# Altium schematic sheet main.SchDoc
size A
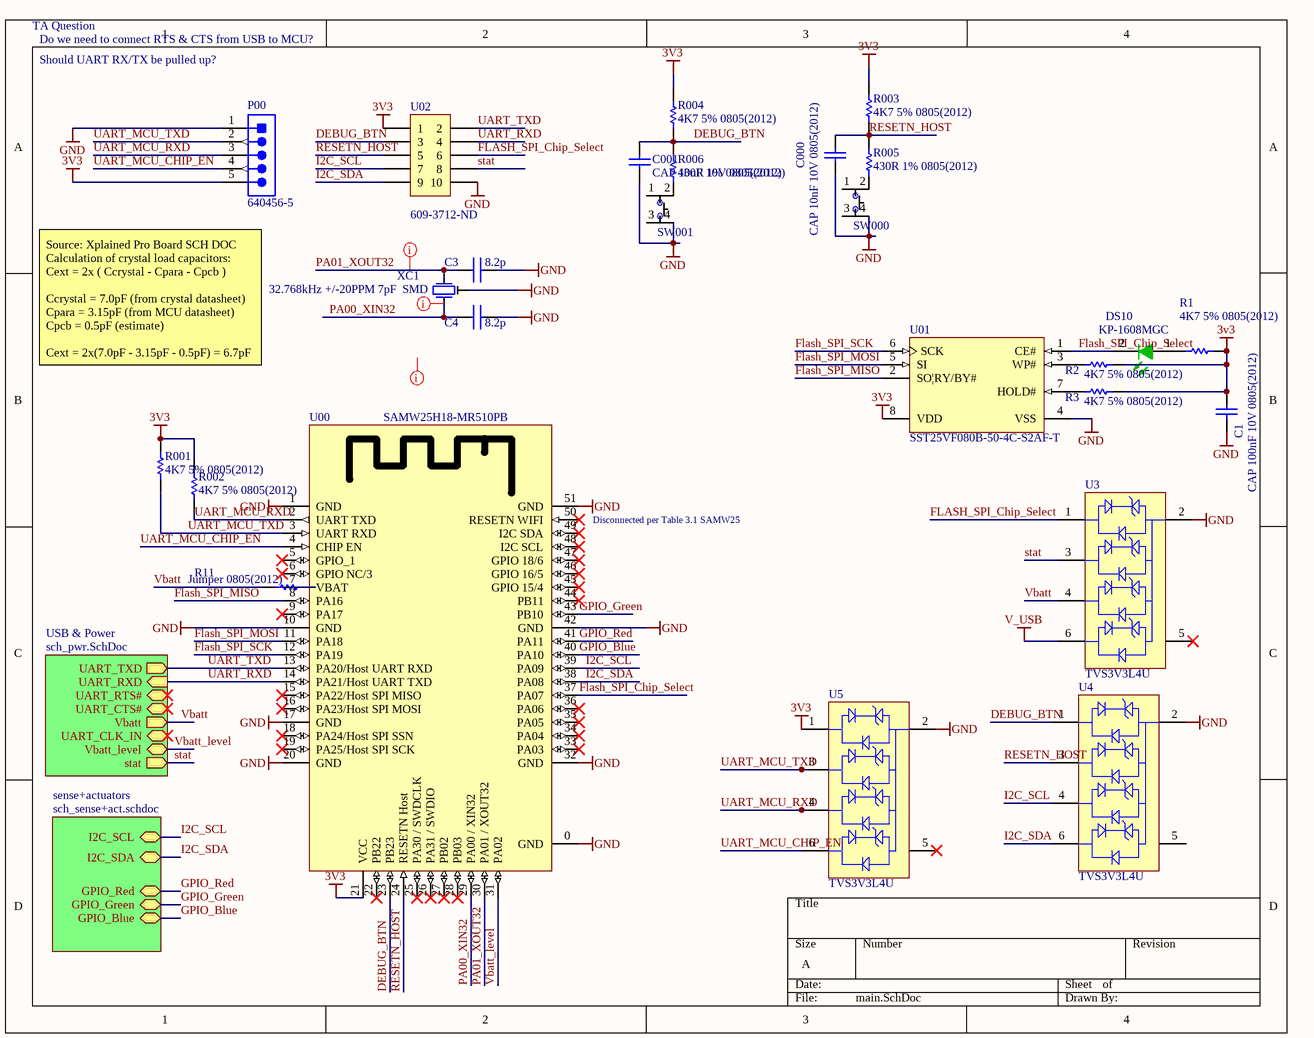
[diagram p0: main.SchDoc]

## Parts
C000  CAP 10nF 10V 0805(2012)  [CAPC0805(2012)75_L]
C1  CAP 100nF 10V 0805(2012)  [CAPC0805(2012)100_N]
C001  CAP 10nF 10V 0805(2012)  [CAPC0805(2012)75_L]
C3  value 8.2p  [AP1-00001]  (hidden comment: CAP-NONPOL)
C4  value 8.2p  [AP1-00001]  (hidden comment: CAP-NONPOL)
DS10  KP-1608MGC  [KING-0603LED_GREEN_V]
P00  640456-5  [TECO-640456-5]
R001  4K7 5% 0805(2012)  [RESC0805(2012)_N]
R1  4K7 5% 0805(2012)  [RESC0805(2012)_N]
R002  4K7 5% 0805(2012)  [RESC0805(2012)_N]
R2  4K7 5% 0805(2012)  [RESC0805(2012)_N]
R003  4K7 5% 0805(2012)  [RESC0805(2012)_N]
R3  4K7 5% 0805(2012)  [RESC0805(2012)_N]
R004  4K7 5% 0805(2012)  [RESC0805(2012)_N]
R005  430R 1% 0805(2012)  [RESC0805(2012)_L]
R006  430R 1% 0805(2012)  [RESC0805(2012)_L]
R11  Jumper 0805(2012)  [RESC0805(2012)_N]
SW000  TL3300DF260Q  [TL3300DF260Q]  (value not drawn)
SW001  TL3300DF260Q  [TL3300DF260Q]  (value not drawn)
U00  SAMW25H18-MR510PB  [SAMW25H18-MR510PB]
U01  SST25VF080B-50-4C-S2AF-T  [MCHP-SOIC-S2A8_N]
U02  Supplier Part Number 1: 609-3712-ND  [20021111-00010T4LF]  (hidden comment: 20021111-00010T4LF)
U3  TVS3V3L4U  [INF-SC74_N]
U4  TVS3V3L4U  [INF-SC74_N]
U5  TVS3V3L4U  [INF-SC74_N]
XC1  value 32.768kHz +/-20PPM 7pF  SMD  [AP7-00044]  (hidden comment: Farnell order no:1539364)

## Sub-sheets
sense+actuators = sch_sense+act.schdoc: I2C_SCL (bidir), I2C_SDA (bidir), GPIO_Red (bidir), GPIO_Green (bidir), GPIO_Blue (bidir)
USB & Power = sch_pwr.SchDoc: stat (out), UART_RXD (in), UART_TXD (out), UART_RTS#, UART_CTS#, UART_CLK_IN, Vbatt_level (bidir), Vbatt (out)

## Nets
3V3: C1.1 P00.5(CTS) R001.1 R1.1 R002.1 R2.1 R003.1 R3.1 R004.1 U00.21(VCC) U01.8(VDD) U02.1 U5.1(C)
GND: C000.1 C001.1 C1.2 C3.2 C4.2 P00.1(DTR) SW000.4 SW001.4 U00.0(GND) U00.1(GND) U00.10(GND) U00.17(GND) U00.20(GND) U00.32(GND) U00.42(GND) U00.51(GND) U01.4(VSS) U02.10 U3.2(C) U4.2(C) U5.2(C) XC1.3
V_USB: U3.6(C)
DEBUG_BTN: C001.2 R004.2 R006.2 U00.23(PB23) U02.3 U4.1(C)
FLASH_SPI_Chip_Select: DS10.2(K) U00.37(PA07) U01.1(CE#) U02.6 U3.1(C)
Flash_SPI_MISO: U00.8(PA16) U01.2(SO|RY/BY#)
Flash_SPI_MOSI: U00.11(PA18) U01.5(SI)
Flash_SPI_SCK: U00.12(PA19) U01.6(SCK)
GPIO_Blue: U00.40(PA10) ; sheet sense+actuators/GPIO_Blue
GPIO_Green: U00.43(PB10) ; sheet sense+actuators/GPIO_Green
GPIO_Red: U00.41(PA11) ; sheet sense+actuators/GPIO_Red
I2C_SCL: U00.39(PA09) U02.7 U4.4(C) ; sheet sense+actuators/I2C_SCL
I2C_SDA: U00.38(PA08) U02.9 U4.6(C) ; sheet sense+actuators/I2C_SDA
PA00_XIN32: C4.1 U00.29(PA00_/_XIN32) XC1.2
PA01_XOUT32: C3.1 U00.30(PA01_/_XOUT32) XC1.1
RESETN_HOST: C000.2 R003.2 R005.2 U00.24(RESETN_Host) U02.5 U4.3(C)
stat: U02.8 U3.3(C) ; sheet USB & Power/stat
UART_MCU_CHIP_EN: P00.4(VCC) U00.4(CHIP_EN) U5.6(C)
UART_MCU_RXD: P00.3(TXO) R002.2 U00.2(UART_TXD) U5.4(C)
UART_MCU_TXD: P00.2(RXI) R001.2 U00.3(UART_RXD) U5.3(C)
UART_RXD: U00.14(PA21/Host_UART_TXD) U02.4 ; sheet USB & Power/UART_RXD
UART_TXD: U00.13(PA20/Host_UART_RXD) U02.2 ; sheet USB & Power/UART_TXD
Vbatt: R11.1 U3.4(C) ; sheet USB & Power/Vbatt
Vbatt_level: U00.31(PA02) ; sheet USB & Power/Vbatt_level
NetR2_2: R2.2 U01.3(WP#)
NetR3_2: R3.2 U01.7(HOLD#)
NetR005_1: R005.1 SW000.2
NetR006_1: R006.1 SW001.2
NetR11_2: R11.2 U00.7(VBAT)

Not connected (* = marked no-connect by the designer): DS10 1(A); R1 2; SW000 1 3; SW001 1 3; U00 5(GPIO_1)* 6(GPIO_NC/3)* 9(PA17)* 15(PA22/Host_SPI_MISO)* 16(PA23/Host_SPI_MOSI)* 18(PA24/Host_SPI_SSN)* 19(PA25/Host_SPI_SCK)* 22(PB22)* 25(PA30_/_SWDCLK)* 26(PA31_/_SWDIO)* 27(PB02)* 28(PB03)* 33(PA03)* 34(PA04)* 35(PA05)* 36(PA06)* 44(PB11)* 45(GPIO_15/4)* 46(GPIO_16/5)* 47(GPIO_18/6)* 48(I2C_SCL)* 49(I2C_SDA)* 50(RESETN_WIFI)*; U3 5(NC)*; U4 5(NC); U5 5(NC)*

## Layout directives
rule Assembly Testpoint Usage [Testpoint - Not Allowed    Multiple - Not Allowed]: (no net found under the mark), PA00_XIN32, PA01_XOUT32

## Notes on the sheet
- TA Question
- Do we need to connect RTS & CTS from USB to MCU?
- Should UART RX/TX be pulled up?
- (near P00) Source: Xplained Pro Board SCH DOC
  Calculation of crystal load capacitors:
  Cext = 2x ( Ccrystal - Cpara - Cpcb )
  Ccrystal = 7.0pF (from crystal datasheet)
  Cpara = 3.15pF (from MCU datasheet)
  Cpcb = 0.5pF (estimate)
  Cext = 2x(7.0pF - 3.15pF - 0.5pF) = 6.7pF
- (near U00) Disconnected per Table 3.1 SAMW25

## Library data of the parts
C000 C001 = CMP-1036-03812-1: CAP 10nF 10V -20% to +80% 0805 (2012 Metric) Thickness 0.75mm SMD; Case-EIA: 0805; Case-Metric: 2012; Technology: SMT; Max Thickness: 0.75 mm; Value: 10nF; Rated Voltage: 10 V; Tolerance: -20% to +80%
C1 = CMP-1036-04396-1: CAP 100nF 10V ±20% 0805 (2012 Metric) Thickness 1mm SMD; Tolerance: Â±20%; Case-Metric: 2012; Case-EIA: 0805; Rated Voltage: 10 V; Value: 100nF; Technology: SMT; Max Thickness: 1 mm
C3 C4 = A01-0014: Ceramic capacitor, SMD 0402, NP0, 50V, +/-5%; PartGroup: Capacitors,Ceramic,SMD 0402; TemperatureRange: -55 - +125 deg C; ComponentStatus: 'Active (verified)'; Status: Active; Verified by: Lars Helge Mo; Verified date: 2005-12-15; AN: A01-0014; Tolerance: 50V, +/-5%; Height: 0.550000011920929; FootprintStatus: 'Active (Verified)'
DS10 = CMP-0404-00001-1: LED, SMT, 0603(1608), 1.1mm thickness, Green; Manufacturer: Kingbright; Reverse Voltage: 5 V; Power Dissipation: 75 mW; Forward Current: 30 mA; Packing Type: 2000 pcs / reel; Mounting Technology: Surface Mount; Storage Temperature: -40 to +85 degC; ComponentLink1URL: http://www.kingbright.com/; PackageDescription: 2-Pin SMT LED, 1.6 x 0.8 mm Pitch; PartNumber: KP-1608MGC; PackageReference: 0603LED_GREEN; ComponentLink1Description: Manufacturer URL
P00 = CMP-1684-00014-1: Male Header, Pitch 2.54 mm, 1 x 5 Position, Height 10.03 mm, Tail Length 3.56 mm, / -55 to 105 degC, RoHS, Bulk; Manufacturer: TE Connectivity; Material, Housing: Polyester; Brand/Series: MTA-100Series; Color, Housing: White; Current, Rating: 5 / A; Temperature, Operating: -55to+105 / °C; Connector Type: MTA-100; Agency Approvals: CSA,UL; Material, Contact: CopperAlloy; Mounting Hole Size: 0.04 / "; Voltage, Rating: 250 / V; Contact Termination Area Plating: Tin; Pin Spacing: 0.1 / "; Primary Type: InterconnectSystem; Special Features: Pinstrip; Mount Angle: Vertical; Contact Centerline Spacing: 0.100 / in.; Number of Contacts: 5; Standards: RoHSCompliant,ELVCompliant,UL94V-0; Angle: Straight; Length, Terminal Post: 0.14 / in.; Manufacturer URL: http://www.te.com; Flammability Rating: UL94V-0; Mounting Type: PCMount; Termination: Solder; Package Reference: THD; Length, Overall: 0.5 / "; Contact Mating Area Plating: Tin; Length, Pin: 0.14 / "; Datasheet URL: http://sigma.octopart.com/77881742/technical_drawing/TE-Connectivity-640456-5.pdf; Package Description: Male Header, Pitch 2.54 mm, 1 x 5 Position, Height 10.03 mm, Tail Length 3.56 mm; Datasheet Version: Rev. W3; Contact Plating: Tin; Color: White; Number of Positions: 5; Type: PCBPlug; Contact Shape: Square; Number of Rows: 1; Size, Post: 0.025 / in.
R001 R1 R002 R2 R003 R3 R004 = CMP-1013-00090-1: 4K7 0.125W 5% 0805 (2012 Metric)  SMD; Case-EIA: 0805; Value: 4700.00 Ohm; Case-Metric: 2012; Power: 0.125 W; Tolerance: 5 %; Technology: SMT
R005 R006 = CMP-1013-00468-1: 430R 0.125W 1% 0805 (2012 Metric)  SMD; Value: 430.00 Ohm; Case-Metric: 2012; Case-EIA: 0805; Power: 0.125 W; Tolerance: 1 %; Technology: SMT
R11 = CMP-1013-00001-1: Jumper 0805 (2012 Metric); Case-EIA: 0805; Value: 0.00 Ohm; Tolerance: None; Case-Metric: 2012; Technology: SMT; Power: None
SW000 SW001 = TL3300DF260Q: SWITCH TACTILE SPST-NO 0.05A 12V; Manufacturer: E-Switch; Mechanical Life: 100000Cycles; Operating Force: 260gf; Current Rating: 50mA; Illumination Type: Non-Illuminated; Throw Configuration: SPST; Switch Travel: 0.35mm; Supplier 1: Digi-Key; Manufacturer Part Number: TL3300DF260Q; Stock 1: 7332; Pricing 1: 1=0.55, 10=0.529, 25=0.5188, 50=0.4992, 100=0.4308, 250=0.3916 (USD); Case/Package: SMD/SMT; Contact Plating: Silver; Min Operating Temperature: -25°C; Max Operating Temperature: 70°C; Package Quantity: 1; Packaging: Tape and Reel; Voltage Rating (DC): 12V; Termination: Gull Wing; Lead Free: Lead Free; ComponentLink1URL: https://datasheet.ciiva.com/2901/n301104-2901040.pdf; ComponentLink1Description: https://datasheet.ciiva.com/2901/n301104-2901040.pdf; Supplier Part Number 1: EG4907CT-ND
U00 = SAMW25H18-MR510PB: RF TXRX MODULE WIFI TRACE ANT; Manufacturer: Atmel; Manufacturer Part Number: ATSAMW25H18-MR510PB; Protocol: 802.11b/g/n; Frequency: 2.4GHz; Data Rate: 65Mbps; Power - Output: 17dBm; Sensitivity: -95.5dBm; Serial Interfaces: SPI, UART; Antenna Type: Integrated, Trace; Memory Size: 256kB Flash, 32kB SRAM; Voltage - Supply: 2.7 V ~ 4.2 V; Category: RF/IF and RFID; Family: RF Transceiver Modules; Series: Xplained Pro; Packaging: Tray; RF Family/Standard: WiFi; Modulation: -; Current - Receiving: -; Current - Transmitting: -; Mounting Type: Surface Mount; Operating Temperature: -40°C ~ 85°C; Package / Case: Module; ComponentLink1URL: http://www.atmel.com/devices/ATSAMW25.aspx; ComponentLink1Description: http://www.atmel.com/devices/ATSAMW25.aspx; ComponentLink2URL: http://www.farnell.com/datasheets/1965115.pdf; ComponentLink2Description: http://www.farnell.com/datasheets/1965115.pdf; Supplier 1: Digikey; Stock 1: 120; Pricing 1: 1=19.14 (USD); Supplier Part Number 1: ATSAMW25H18-MR510PB-ND
U01 = CMP-0378-00054-1: 8 Mbit SPI Serial Flash, 2.7 to 3.6 V, 50 MHz, 0 to 70 degC, 8-pin SOIC (S2A8), Tape and Reel; Manufacturer: Microchip; Mounting Technology: Surface Mount; ComponentLink2Description: Datasheet; PackageDescription: 8-Lead Plastic Small Outline Intergrated Circuit, 5.275 x 5.275 mm Body, 1.27 mm Pitch; DatasheetVersion: Rev. A; ComponentLink1Description: Manufacturer URL; PackageVersion: Rev. A; ComponentLink3Description: Package Specification; PackageReference: SOIC-S2A8; ComponentLink3URL: http://ww1.microchip.com/downloads/en/DeviceDoc/25051A.pdf; ComponentLink4Description: Product URL; ComponentLink2URL: http://ww1.microchip.com/downloads/en/DeviceDoc/25045A.pdf; PartNumber: SST25VF080B-50-4C-S2AF-T; ComponentLink4URL: http://www.microchip.com/SST25VF080B; ComponentLink1URL: http://www.microchip.com
U02 = 20021111-00010T4LF: CONN HEADER 10POS UNSHD VERT T/H; Manufacturer: Amphenol / FCI; Stack Height: 2.5 mm; Number of Positions / Contacts: 10; Brand: FCI; Pitch: 1.27 mm; Mounting Angle: Vertical; Current Rating: 10 A; Mating Post Length: 3.05 mm; Voltage Rating: 125 V; Manufacturer Part Number: 20021111-00010T4LF; Mounting Style: Through Hole; Product Category: Headers & Wire Housings; RoHS: Details; Series: Minitek; Product Type: Headers; Type: Unshrouded; Number of Positions: 10; Number of Rows: 2; Contact Plating: Gold; Housing Material: Plastic; Termination Style: Through Hole; Contact Material: Nickel; Packaging: Tube; Factory Pack Quantity: 93; Termination Post Length: 2.3 mm; ComponentLink1URL: https://datasheet.ciiva.com/1433/1079612-1433267.pdf; ComponentLink1Description: https://datasheet.ciiva.com/1433/1079612-1433267.pdf; ComponentLink2URL: https://datasheet.ciiva.com/409/20021111-409158.pdf; ComponentLink2Description: https://datasheet.ciiva.com/409/20021111-409158.pdf; ComponentLink3URL: https://datasheet.ciiva.com/5131/20021111-5131386.pdf; ComponentLink3Description: https://datasheet.ciiva.com/5131/20021111-5131386.pdf; ComponentLink4URL: https://datasheet.ciiva.com/9465/20021111-9465402.pdf; ComponentLink4Description: https://datasheet.ciiva.com/9465/20021111-9465402.pdf; Supplier 1: Digi-Key
U3-U5 = CMP-1179-00001-1: Low Capacitance ESD / Transient / Surge Protection Array, -55 to 125 degC, SC74, Reel, Green; Manufacturer: Infineon; VESD (max): 30Â kV; VESD (min): -30Â kV; CL (typ): 2Â pF; CL (max): 3Â pF; IR (max): 50Â uA; IEFT: 80 A; VRWM: 3.3Â V; Green: TRUE; Rdyn typ reverse: 9Â Ohm; Rdyn typ forward: 0.12Â Ohm; ComponentLink2Description: Datasheet; Mounting Technology: Surface Mount; ComponentLink3Description: Package Specification; ComponentLink2URL: http://www.infineon.com/dgdl/TVS3V3L4U_rev_2_2.pdf?folderId=db3a30431f848401011fcbf2ab4c04c4&fileId=db3a3043382e837301385be7912532ed; ComponentLink1Description: Manufacturer URL; PackageDescription: 6-Pin Semiconductor Package, 2.9 x 1.6 mm Body, 0.95 mm Pitch; ComponentLink3URL: http://www.infineon.com/dgdl/SC74-Package_Overview.pdf?folderId=db3a30431936bc4b01194dec844f40d9&fileId=db3a30431936bc4b01195175d46e3ab3; PackageVersion: Apr-08; DatasheetVersion: Rev. 2.2; ComponentLink1URL: http://www.infineon.com/; Packing: Reel; PackageReference: SC74; PartNumber: TVS3V3L4U
XC1 = A07-0052: 32k768 crystal, +-20ppm, CL=7pF, max ESR 60kOhm, SMD; PartGroup: Frequency devices,Crystals,SMD; Manufacturer: Micro Crystal; MPN: MS1V-T1K 32.768kHz 7pF +/-20PPM TA; Tolerance: +/- 20 PPM; TemperatureRange: -40 /+85; ComponentStatus: 'Active (verified)'; AN: A07-0052; Height: 2,07999992370605; FootprintStatus: 'Active (Verified)'